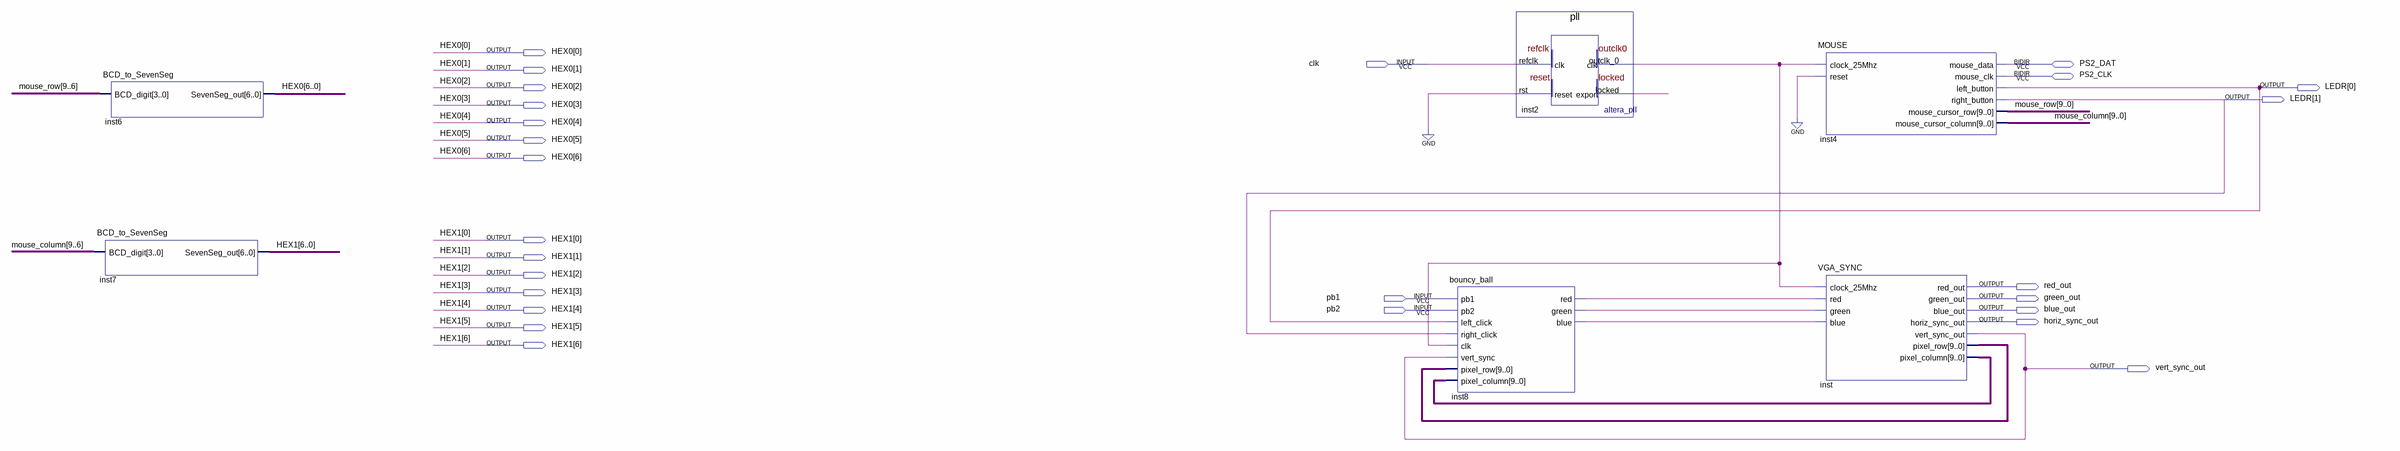
[diagram p0: schematic sheet]
// Quartus schematic bouncing_ball_screen.bdf as structural Verilog: 6 symbols, 26 pins
module bouncing_ball_screen (
  input  clk,
  input  pb1,
  input  pb2,
  inout  PS2_DAT,
  inout  PS2_CLK,
  output [6:0] HEX0,
  output [1:0] LEDR,
  output [6:0] HEX1,
  output red_out,
  output green_out,
  output blue_out,
  output horiz_sync_out,
  output vert_sync_out
);

  wire inst2_locked, inst2_outclk_0, inst8_blue, inst8_green, inst8_red;
  wire [9:0] inst_pixel_column, inst_pixel_row, mouse_column, mouse_row;

  BCD_to_SevenSeg inst6 (.BCD_digit(mouse_row[9:6]), .SevenSeg_out(HEX0));
  BCD_to_SevenSeg inst7 (.BCD_digit(mouse_column[9:6]), .SevenSeg_out(HEX1));
  bouncy_ball inst8 (
    .pb1(pb1), .pb2(pb2), .left_click(LEDR[0]), .right_click(LEDR[1]), .clk(inst2_outclk_0),
    .vert_sync(vert_sync_out), .pixel_row(inst_pixel_row), .pixel_column(inst_pixel_column), .red(inst8_red),
    .green(inst8_green), .blue(inst8_blue));
  pll inst2 (.refclk(clk), .rst(1'b0), .outclk_0(inst2_outclk_0), .locked(inst2_locked));
  MOUSE inst4 (
    .clock_25Mhz(inst2_outclk_0), .reset(1'b0), .left_button(LEDR[0]), .right_button(LEDR[1]),
    .mouse_cursor_row(mouse_row), .mouse_cursor_column(mouse_column), .mouse_data(PS2_DAT),
    .mouse_clk(PS2_CLK));
  VGA_SYNC inst (
    .clock_25Mhz(inst2_outclk_0), .red(inst8_red), .green(inst8_green), .blue(inst8_blue), .red_out(red_out),
    .green_out(green_out), .blue_out(blue_out), .horiz_sync_out(horiz_sync_out),
    .vert_sync_out(vert_sync_out), .pixel_row(inst_pixel_row), .pixel_column(inst_pixel_column));
endmodule
